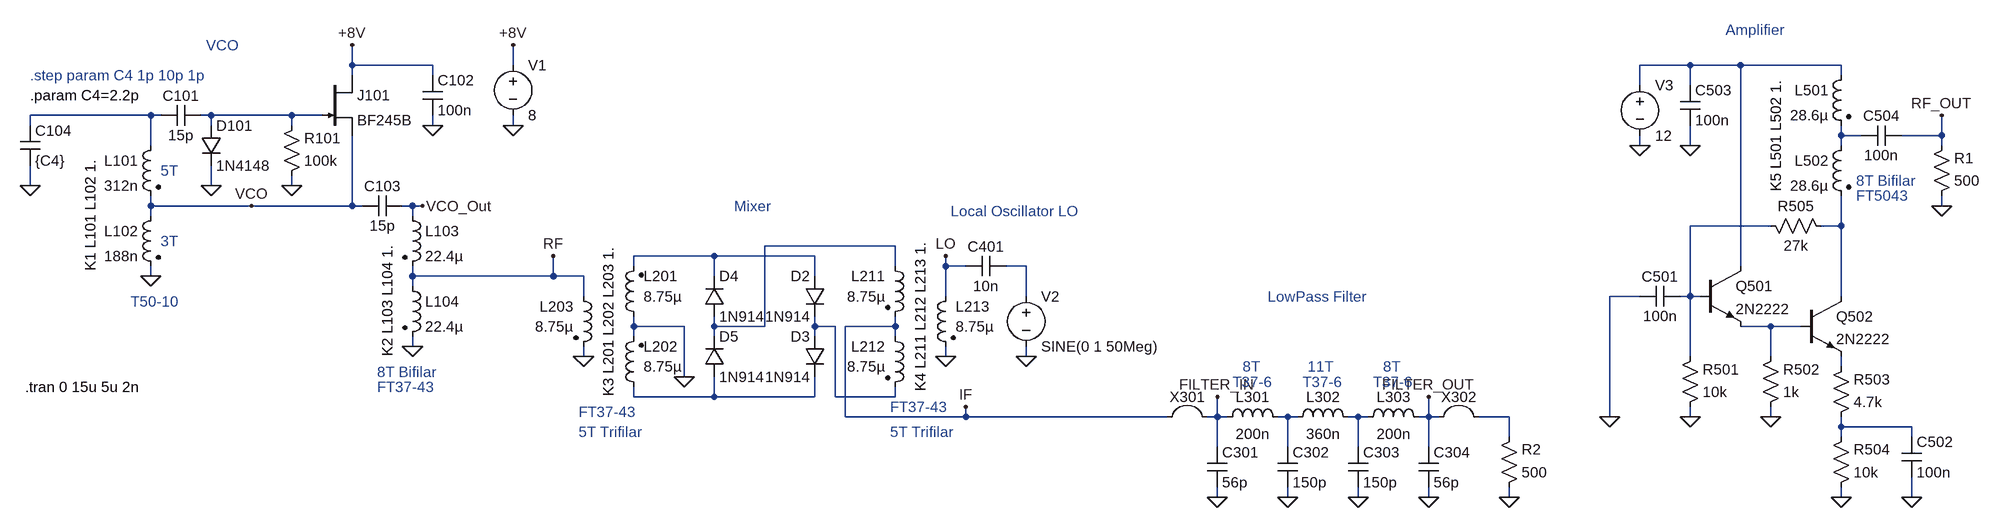
[diagram p0: schematic 3-50MHzSweeper.asc]
3-50MHzSweeper.asc, the LTspice schematic file:
Version 4
SHEET 1 3164 932
WIRE -592 -384 -592 -416
WIRE -464 -384 -592 -384
WIRE -336 -384 -336 -416
WIRE 1536 -384 1456 -384
WIRE 1616 -384 1536 -384
WIRE 1776 -384 1616 -384
WIRE -592 -368 -592 -384
WIRE -464 -368 -464 -384
WIRE 1776 -368 1776 -384
WIRE 1456 -352 1456 -384
WIRE 1536 -352 1536 -384
WIRE -912 -304 -1104 -304
WIRE -896 -304 -912 -304
WIRE -816 -304 -832 -304
WIRE -688 -304 -816 -304
WIRE -640 -304 -688 -304
WIRE -1104 -288 -1104 -304
WIRE -816 -288 -816 -304
WIRE -688 -288 -688 -304
WIRE -464 -288 -464 -304
WIRE -336 -288 -336 -304
WIRE 1776 -272 1776 -288
WIRE 1808 -272 1776 -272
WIRE 1936 -272 1936 -304
WIRE 1936 -272 1872 -272
WIRE -912 -256 -912 -304
WIRE 1456 -256 1456 -272
WIRE 1536 -256 1536 -288
WIRE 1776 -256 1776 -272
WIRE 1936 -256 1936 -272
WIRE -1104 -192 -1104 -224
WIRE -816 -192 -816 -224
WIRE -688 -192 -688 -208
WIRE -912 -160 -912 -176
WIRE -752 -160 -912 -160
WIRE -592 -160 -592 -272
WIRE -592 -160 -752 -160
WIRE -576 -160 -592 -160
WIRE -496 -160 -512 -160
WIRE -480 -160 -496 -160
WIRE 1936 -160 1936 -176
WIRE -912 -144 -912 -160
WIRE -496 -144 -496 -160
WIRE 1664 -128 1536 -128
WIRE 1776 -128 1776 -176
WIRE 1776 -128 1744 -128
WIRE 272 -96 64 -96
WIRE -16 -80 -144 -80
WIRE 144 -80 -16 -80
WIRE -144 -64 -144 -80
WIRE 272 -64 272 -96
WIRE 352 -64 352 -80
WIRE 384 -64 352 -64
WIRE 480 -64 448 -64
WIRE 1616 -64 1616 -384
WIRE -912 -48 -912 -64
WIRE -496 -48 -496 -64
WIRE -272 -48 -272 -80
WIRE -272 -48 -496 -48
WIRE -224 -48 -272 -48
WIRE -16 -48 -16 -80
WIRE 144 -48 144 -80
WIRE -496 -32 -496 -48
WIRE -224 -16 -224 -48
WIRE 352 -16 352 -64
WIRE 480 -16 480 -64
WIRE 1456 -16 1408 -16
WIRE 1536 -16 1536 -128
WIRE 1536 -16 1520 -16
WIRE 1552 -16 1536 -16
WIRE 1776 -16 1776 -128
WIRE -144 32 -144 16
WIRE -64 32 -144 32
WIRE -16 32 -16 16
WIRE 64 32 64 -96
WIRE 64 32 -16 32
WIRE 144 32 144 16
WIRE 176 32 144 32
WIRE 272 32 272 16
WIRE 272 32 192 32
WIRE 1664 32 1616 32
WIRE 1712 32 1664 32
WIRE -144 48 -144 32
WIRE -16 48 -16 32
WIRE 144 48 144 32
WIRE 272 48 272 32
WIRE -496 64 -496 48
WIRE -224 80 -224 64
WIRE 352 80 352 64
WIRE 480 80 480 64
WIRE 1536 80 1536 -16
WIRE 1664 80 1664 32
WIRE 1776 96 1776 80
WIRE -64 112 -64 32
WIRE -144 144 -144 128
WIRE -16 144 -16 112
WIRE -16 144 -144 144
WIRE 144 144 144 112
WIRE 144 144 -16 144
WIRE 176 144 176 32
WIRE 272 144 272 128
WIRE 272 144 176 144
WIRE 192 176 192 32
WIRE 384 176 384 160
WIRE 384 176 192 176
WIRE 704 176 384 176
WIRE 784 176 784 144
WIRE 784 176 768 176
WIRE 800 176 784 176
WIRE 896 176 880 176
WIRE 912 176 896 176
WIRE 1008 176 992 176
WIRE 1024 176 1008 176
WIRE 1120 176 1120 144
WIRE 1120 176 1104 176
WIRE 1136 176 1120 176
WIRE 1248 176 1200 176
WIRE 1408 176 1408 -16
WIRE 1536 176 1536 160
WIRE 1664 176 1664 160
WIRE 1776 192 1776 176
WIRE 1888 192 1776 192
WIRE 1248 208 1248 176
WIRE 1776 208 1776 192
WIRE 1888 208 1888 192
WIRE 784 224 784 176
WIRE 896 224 896 176
WIRE 1008 224 1008 176
WIRE 1120 224 1120 176
WIRE 784 304 784 288
WIRE 896 304 896 288
WIRE 1008 304 1008 288
WIRE 1120 304 1120 288
WIRE 1248 304 1248 288
WIRE 1776 304 1776 288
WIRE 1888 304 1888 272
FLAG -688 -192 0
FLAG -816 -192 0
FLAG -464 -288 0
FLAG -912 -48 0
FLAG -1104 -192 0
FLAG -336 -288 0
FLAG -336 -416 +8V
FLAG -592 -416 +8V
FLAG -224 80 0
FLAG 352 80 0
FLAG -64 112 0
FLAG -496 64 0
FLAG 480 80 0
FLAG 1536 176 0
FLAG 352 -80 LO
FLAG -272 -80 RF
FLAG 384 160 IF
FLAG -480 -160 VCO_Out
FLAG 784 304 0
FLAG 896 304 0
FLAG 1008 304 0
FLAG 1120 304 0
FLAG 1664 176 0
FLAG 1776 304 0
FLAG 1888 304 0
FLAG 1456 -256 0
FLAG 1536 -256 0
FLAG 1936 -160 0
FLAG -752 -160 VCO
FLAG 1936 -304 RF_OUT
FLAG 784 144 FILTER_IN
FLAG 1120 144 FILTER_OUT
FLAG 1408 176 0
FLAG 1248 304 0
SYMBOL cap -832 -320 R90
WINDOW 0 0 32 VBottom 2
WINDOW 3 32 32 VTop 2
SYMATTR InstName C101
SYMATTR Value 15p
SYMBOL cap -480 -368 R0
SYMATTR InstName C102
SYMATTR Value 100n
SYMBOL ind2 -896 -272 M0
SYMATTR InstName L101
SYMATTR Value 312n
SYMATTR Type ind
SYMBOL res -704 -192 M180
WINDOW 0 36 76 Left 2
WINDOW 3 36 40 Left 2
SYMATTR InstName R101
SYMATTR Value 100k
SYMBOL diode -832 -288 R0
SYMATTR InstName D101
SYMATTR Value 1N4148
SYMBOL njf -640 -368 R0
SYMATTR InstName J101
SYMATTR Value BF245B
SYMBOL ind2 -896 -160 M0
SYMATTR InstName L102
SYMATTR Value 188n
SYMATTR Type ind
SYMBOL cap -1120 -288 R0
SYMATTR InstName C104
SYMATTR Value {C4}
SYMBOL voltage -336 -400 R0
WINDOW 123 0 0 Left 2
WINDOW 39 0 0 Left 2
SYMATTR InstName V1
SYMATTR Value 8
SYMBOL ind2 -128 32 R180
WINDOW 0 0 80 Right 2
WINDOW 3 0 48 Right 2
SYMATTR InstName L201
SYMATTR Value 8.75µ
SYMATTR Type ind
SYMBOL ind2 -128 144 R180
WINDOW 0 0 80 Right 2
WINDOW 3 0 48 Right 2
SYMATTR InstName L202
SYMATTR Value 8.75µ
SYMATTR Type ind
SYMBOL ind2 -240 -32 R0
WINDOW 0 0 32 Right 2
WINDOW 3 0 64 Right 2
SYMATTR InstName L203
SYMATTR Value 8.75µ
SYMATTR Type ind
SYMATTR SpiceLine Rser=2
SYMBOL ind2 256 -80 R0
WINDOW 0 0 32 Right 2
WINDOW 3 0 64 Right 2
SYMATTR InstName L211
SYMATTR Value 8.75µ
SYMATTR Type ind
SYMBOL ind2 256 32 R0
WINDOW 0 0 32 Right 2
WINDOW 3 0 64 Right 2
SYMATTR InstName L212
SYMATTR Value 8.75µ
SYMATTR Type ind
SYMBOL ind2 368 -32 M0
WINDOW 0 0 32 Right 2
WINDOW 3 0 64 Right 2
SYMATTR InstName L213
SYMATTR Value 8.75µ
SYMATTR Type ind
SYMBOL diode 160 -48 M0
SYMATTR InstName D2
SYMATTR Value 1N914
SYMBOL diode 160 48 M0
SYMATTR InstName D3
SYMATTR Value 1N914
SYMBOL diode -32 16 M180
WINDOW 0 24 64 Left 2
WINDOW 3 24 0 Left 2
SYMATTR InstName D4
SYMATTR Value 1N914
SYMBOL diode -32 112 M180
WINDOW 0 24 64 Left 2
WINDOW 3 24 0 Left 2
SYMATTR InstName D5
SYMATTR Value 1N914
SYMBOL cap -512 -176 R90
WINDOW 0 0 32 VBottom 2
WINDOW 3 32 32 VTop 2
SYMATTR InstName C103
SYMATTR Value 15p
SYMBOL ind2 -512 -160 R0
SYMATTR InstName L103
SYMATTR Value 22.4µ
SYMATTR Type ind
SYMBOL ind2 -512 -48 R0
SYMATTR InstName L104
SYMATTR Value 22.4µ
SYMATTR Type ind
SYMBOL voltage 480 -32 R0
WINDOW 123 0 0 Left 2
WINDOW 39 0 0 Left 2
SYMATTR InstName V2
SYMATTR Value SINE(0 1 50Meg)
SYMBOL cap 448 -80 R90
WINDOW 0 0 32 VBottom 2
WINDOW 3 32 32 VTop 2
SYMATTR InstName C401
SYMATTR Value 10n
SYMBOL res 1520 176 M180
WINDOW 0 36 76 Left 2
WINDOW 3 36 40 Left 2
SYMATTR InstName R501
SYMATTR Value 10k
SYMBOL ind 784 192 R270
WINDOW 0 32 56 VTop 2
WINDOW 3 5 56 VBottom 2
SYMATTR InstName L301
SYMATTR Value 200n
SYMBOL ind 896 192 R270
WINDOW 0 32 56 VTop 2
WINDOW 3 5 56 VBottom 2
SYMATTR InstName L302
SYMATTR Value 360n
SYMBOL ind 1008 192 R270
WINDOW 0 32 56 VTop 2
WINDOW 3 5 56 VBottom 2
SYMATTR InstName L303
SYMATTR Value 200n
SYMBOL cap 880 224 R0
SYMATTR InstName C302
SYMATTR Value 150p
SYMBOL cap 992 224 R0
SYMATTR InstName C303
SYMATTR Value 150p
SYMBOL cap 1104 224 R0
SYMATTR InstName C304
SYMATTR Value 56p
SYMBOL cap 768 224 R0
SYMATTR InstName C301
SYMATTR Value 56p
SYMBOL cap 1520 -32 R90
WINDOW 0 0 32 VBottom 2
WINDOW 3 32 32 VTop 2
SYMATTR InstName C501
SYMATTR Value 100n
SYMBOL npn 1552 -64 R0
SYMATTR InstName Q501
SYMATTR Value 2N2222
SYMBOL res 1648 176 M180
WINDOW 0 36 76 Left 2
WINDOW 3 36 40 Left 2
SYMATTR InstName R502
SYMATTR Value 1k
SYMBOL res 1760 192 M180
WINDOW 0 36 76 Left 2
WINDOW 3 36 40 Left 2
SYMATTR InstName R503
SYMATTR Value 4.7k
SYMBOL res 1760 304 M180
WINDOW 0 36 76 Left 2
WINDOW 3 36 40 Left 2
SYMATTR InstName R504
SYMATTR Value 10k
SYMBOL res 1648 -144 M90
WINDOW 0 0 56 VBottom 2
WINDOW 3 32 56 VTop 2
SYMATTR InstName R505
SYMATTR Value 27k
SYMBOL npn 1712 -16 R0
SYMATTR InstName Q502
SYMATTR Value 2N2222
SYMBOL cap 1872 208 R0
SYMATTR InstName C502
SYMATTR Value 100n
SYMBOL voltage 1456 -368 R0
WINDOW 123 0 0 Left 2
WINDOW 39 0 0 Left 2
SYMATTR InstName V3
SYMATTR Value 12
SYMBOL ind2 1792 -384 M0
SYMATTR InstName L501
SYMATTR Value 28.6µ
SYMATTR Type ind
SYMBOL ind2 1792 -272 M0
SYMATTR InstName L502
SYMATTR Value 28.6µ
SYMATTR Type ind
SYMBOL cap 1520 -352 R0
SYMATTR InstName C503
SYMATTR Value 100n
SYMBOL cap 1872 -288 R90
WINDOW 0 0 32 VBottom 2
WINDOW 3 32 32 VTop 2
SYMATTR InstName C504
SYMATTR Value 100n
SYMBOL res 1920 -160 M180
WINDOW 0 36 76 Left 2
WINDOW 3 36 40 Left 2
SYMATTR InstName R1
SYMATTR Value 500
SYMBOL Misc\\jumper 736 112 R0
SYMATTR InstName X301
SYMBOL Misc\\jumper 1168 112 R0
SYMATTR InstName X302
SYMBOL res 1232 304 M180
WINDOW 0 36 76 Left 2
WINDOW 3 36 40 Left 2
SYMATTR InstName R2
SYMATTR Value 500
TEXT -1008 -56 VLeft 2 !K1 L101 L102 1.
TEXT -1112 128 Left 2 !.tran 0 15u 5u 2n
TEXT -1104 -368 Left 2 ;.step param C4 1p 10p 1p
TEXT -1104 -336 Left 2 !.param C4=2.2p
TEXT -184 144 VLeft 2 !K3 L201 L202 L203 1.
TEXT 312 136 VLeft 2 !K4 L211 L212 L213 1.
TEXT -536 80 VLeft 2 !K2 L103 L104 1.
TEXT 1672 -360 VRight 2 !K5 L501 L502 1.
TEXT -824 -416 Left 2 ;VCO
TEXT 16 -160 Left 2 ;Mixer
TEXT 360 -152 Left 2 ;Local Oscillator LO
TEXT 864 -16 Left 2 ;LowPass Filter
TEXT 1592 -440 Left 2 ;Amplifier
TEXT -896 -216 Left 2 ;5T
TEXT -896 -104 Left 2 ;3T
TEXT -944 -8 Left 2 ;T50-10
TEXT -552 104 Left 2 ;8T Bifilar
TEXT -552 128 Left 2 ;FT37-43
TEXT -232 168 Left 2 ;FT37-43
TEXT 264 160 Left 2 ;FT37-43
TEXT -232 200 Left 2 ;5T Trifilar
TEXT 264 200 Left 2 ;5T Trifilar
TEXT 808 120 Left 2 ;T37-6
TEXT 920 120 Left 2 ;T37-6
TEXT 1032 120 Left 2 ;T37-6
TEXT 928 96 Left 2 ;11T
TEXT 824 96 Left 2 ;8T
TEXT 1048 96 Left 2 ;8T
TEXT 1800 -200 Left 2 ;8T Bifilar
TEXT 1800 -176 Left 2 ;FT5043

The netlist it stands for:
* 3-50MHzSweeper.asc
C101 N003 N002 15p
C102 +8V 0 100n
L101 N002 VCO 312n
R101 0 N003 100k
D101 N003 0 1N4148
J101 +8V N003 VCO BF245B
L102 VCO 0 188n
C104 N002 0 {C4}
V1 +8V 0 8
L201 0 N008 8.75µ
L202 N013 0 8.75µ
L203 RF 0 8.75µ Rser=2
L211 N007 FILTER_IN 8.75µ
L212 FILTER_IN N010 8.75µ
L213 LO 0 8.75µ
D2 N008 N010 1N914
D3 N010 N013 1N914
D4 N007 N008 1N914
D5 N013 N007 1N914
C103 VCO_Out VCO 15p
L103 VCO_Out RF 22.4µ
L104 RF 0 22.4µ
V2 N009 0 SINE(0 1 50Meg)
C401 N009 LO 10n
R501 0 N005 10k
L301 FILTER_IN N014 200n
L302 N014 N015 360n
L303 N015 FILTER_OUT 200n
C302 N014 0 150p
C303 N015 0 150p
C304 FILTER_OUT 0 56p
C301 FILTER_IN 0 56p
C501 N005 0 100n
Q501 N001 N005 N011 0 2N2222
R502 0 N011 1k
R503 N016 N012 4.7k
R504 0 N016 10k
R505 N005 N006 27k
Q502 N006 N011 N012 0 2N2222
C502 N016 0 100n
V3 N001 0 12
L501 N001 N004 28.6µ
L502 N004 N006 28.6µ
C503 N001 0 100n
C504 RF_OUT N004 100n
R1 0 RF_OUT 500
R2 0 FILTER_OUT 500
.model D D
.lib standard.dio
.model NPN NPN
.model PNP PNP
.lib standard.bjt
.model NJF NJF
.model PJF PJF
.lib standard.jft
K1 L101 L102 1.
.tran 0 15u 5u 2n
* .step param C4 1p 10p 1p
.param C4=2.2p
K3 L201 L202 L203 1.
K4 L211 L212 L213 1.
K2 L103 L104 1.
K5 L501 L502 1.
* VCO
* Mixer
* Local Oscillator LO
* LowPass Filter
* Amplifier
* 5T
* 3T
* T50-10
* 8T Bifilar
* FT37-43
* FT37-43
* FT37-43
* 5T Trifilar
* 5T Trifilar
* T37-6
* T37-6
* T37-6
* 11T
* 8T
* 8T
* 8T Bifilar
* FT5043
.backanno
.end